# EasyEDA Pro project 面包板.eprj

# Schematic Schematic1
Create Date: 2023-08-23; Page Name: P1; Project Name: 面包板; Schematic Name: Schematic1; Update Date: 2023-08-23; Company: 嘉立创EDA; Page Size: A4; Version: V1.0
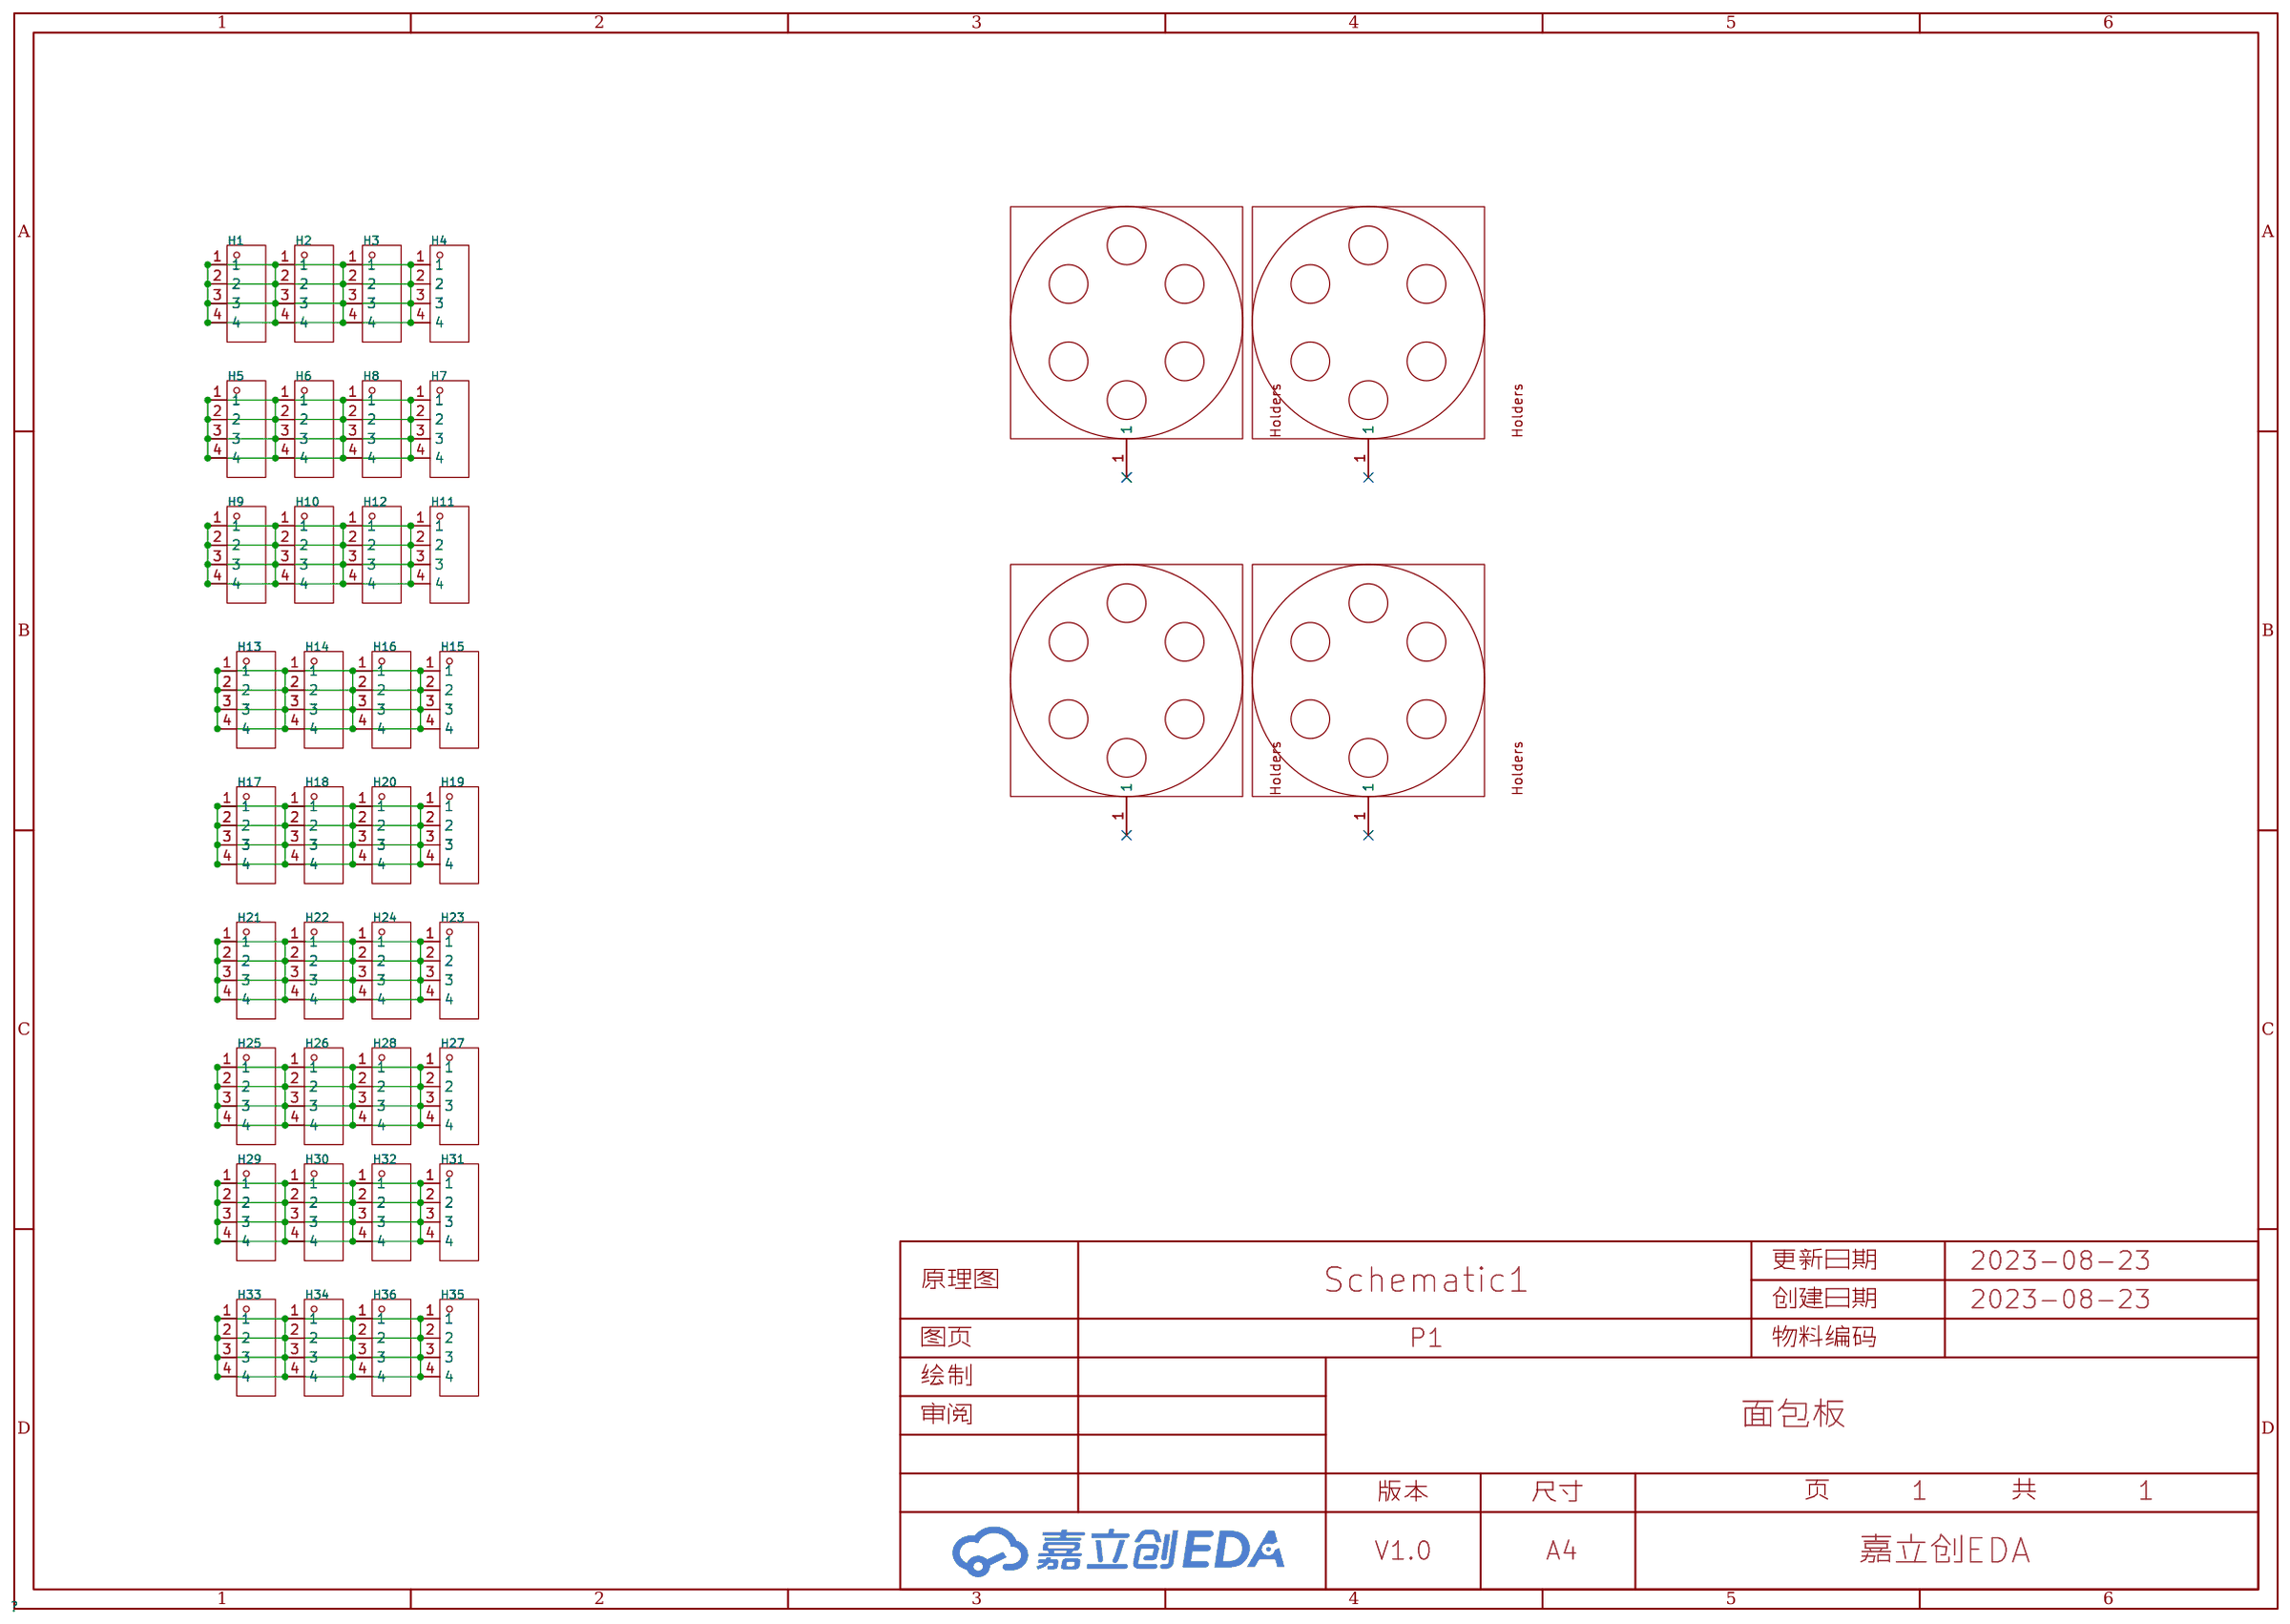
[diagram p0: schematic sheet]

## Parts
H1  PZ254V-11-04P  [HDR-TH_4P-P2.54-V-M]
H2  PZ254V-11-04P  [HDR-TH_4P-P2.54-V-M]
H3  PZ254V-11-04P  [HDR-TH_4P-P2.54-V-M]
H4  PZ254V-11-04P  [HDR-TH_4P-P2.54-V-M]
H5  PZ254V-11-04P  [HDR-TH_4P-P2.54-V-M]
H6  PZ254V-11-04P  [HDR-TH_4P-P2.54-V-M]
H7  PZ254V-11-04P  [HDR-TH_4P-P2.54-V-M]
H8  PZ254V-11-04P  [HDR-TH_4P-P2.54-V-M]
H9  PZ254V-11-04P  [HDR-TH_4P-P2.54-V-M]
H10  PZ254V-11-04P  [HDR-TH_4P-P2.54-V-M]
H11  PZ254V-11-04P  [HDR-TH_4P-P2.54-V-M]
H12  PZ254V-11-04P  [HDR-TH_4P-P2.54-V-M]
H13  PZ254V-11-04P  [HDR-TH_4P-P2.54-V-M]
H14  PZ254V-11-04P  [HDR-TH_4P-P2.54-V-M]
H15  PZ254V-11-04P  [HDR-TH_4P-P2.54-V-M]
H16  PZ254V-11-04P  [HDR-TH_4P-P2.54-V-M]
H17  PZ254V-11-04P  [HDR-TH_4P-P2.54-V-M]
H18  PZ254V-11-04P  [HDR-TH_4P-P2.54-V-M]
H19  PZ254V-11-04P  [HDR-TH_4P-P2.54-V-M]
H20  PZ254V-11-04P  [HDR-TH_4P-P2.54-V-M]
H21  PZ254V-11-04P  [HDR-TH_4P-P2.54-V-M]
H22  PZ254V-11-04P  [HDR-TH_4P-P2.54-V-M]
H23  PZ254V-11-04P  [HDR-TH_4P-P2.54-V-M]
H24  PZ254V-11-04P  [HDR-TH_4P-P2.54-V-M]
H25  PZ254V-11-04P  [HDR-TH_4P-P2.54-V-M]
H26  PZ254V-11-04P  [HDR-TH_4P-P2.54-V-M]
H27  PZ254V-11-04P  [HDR-TH_4P-P2.54-V-M]
H28  PZ254V-11-04P  [HDR-TH_4P-P2.54-V-M]
H29  PZ254V-11-04P  [HDR-TH_4P-P2.54-V-M]
H30  PZ254V-11-04P  [HDR-TH_4P-P2.54-V-M]
H31  PZ254V-11-04P  [HDR-TH_4P-P2.54-V-M]
H32  PZ254V-11-04P  [HDR-TH_4P-P2.54-V-M]
H33  PZ254V-11-04P  [HDR-TH_4P-P2.54-V-M]
H34  PZ254V-11-04P  [HDR-TH_4P-P2.54-V-M]
H35  PZ254V-11-04P  [HDR-TH_4P-P2.54-V-M]
H36  PZ254V-11-04P  [HDR-TH_4P-P2.54-V-M]
J1  -  [DEMO板安装孔]
J2  -  [DEMO板安装孔]
J3  -  [DEMO板安装孔]
J4  -  [DEMO板安装孔]

## Library data of the parts
H1-H36 = PZ254V-11-04P: 排数:单排;总PIN位数:4P;间距:2.54mm;插针结构:1x4P;行距:-;安装类型:直插;圆针/方针:方针;额定电流:3A;额定电压:250V;配合针长度:6mm;塑高:2.5mm;端接针长度:3mm;触头材质:-;工作温度范围:-40℃~+105℃;颜色:黑色;; LCSC Part Name: 2.54mm 1x4P 直插 方针; Supplier Part: C2691448; Manufacturer: XFCN(兴飞); Supplier Footprint: 插件,P=2.54mm; JLCPCB Part Class: Extended Part; Datasheet: https://atta.szlcsc.com/upload/public/pdf/source/20200309/C492403_F9F19131791D08044AD4F84F8E751A34.pdf; Supplier: LCSC; Number of Rows: 单排; Number of Pins: 4P; Pitch: 2.54mm; Pin Structure: 1x4P; Mounting Type: 直插; Circluar Pins/Square Pins: 方针; Current Rating (Max): 3A; Voltage Rating (Max): 250V; Length of Mating Pin: 6mm; Insulation Height: 2.5mm; Length of End Connection Pin: 3mm; Operating Temperature Range: -40℃~+105℃; Color: 黑色
J1-J4 = 螺孔_3.1X6MM

## Nets
$1N396: H1.1 H1.2 H1.3 H1.4 H2.1 H2.2 H2.3 H2.4 H3.1 H3.2 H3.3 H3.4 H4.1 H4.2 H4.3 H4.4
$1N597: H5.1 H5.2 H5.3 H5.4 H6.1 H6.2 H6.3 H6.4 H7.1 H7.2 H7.3 H7.4 H8.1 H8.2 H8.3 H8.4
$1N814: H9.1 H9.2 H9.3 H9.4 H10.1 H10.2 H10.3 H10.4 H11.1 H11.2 H11.3 H11.4 H12.1 H12.2 H12.3 H12.4
$1N1031: H13.1 H13.2 H13.3 H13.4 H14.1 H14.2 H14.3 H14.4 H15.1 H15.2 H15.3 H15.4 H16.1 H16.2 H16.3 H16.4
$1N1248: H17.1 H17.2 H17.3 H17.4 H18.1 H18.2 H18.3 H18.4 H19.1 H19.2 H19.3 H19.4 H20.1 H20.2 H20.3 H20.4
$1N1465: H21.1 H21.2 H21.3 H21.4 H22.1 H22.2 H22.3 H22.4 H23.1 H23.2 H23.3 H23.4 H24.1 H24.2 H24.3 H24.4
$1N1682: H25.1 H25.2 H25.3 H25.4 H26.1 H26.2 H26.3 H26.4 H27.1 H27.2 H27.3 H27.4 H28.1 H28.2 H28.3 H28.4
$1N1899: H29.1 H29.2 H29.3 H29.4 H30.1 H30.2 H30.3 H30.4 H31.1 H31.2 H31.3 H31.4 H32.1 H32.2 H32.3 H32.4
$1N2116: H33.1 H33.2 H33.3 H33.4 H34.1 H34.2 H34.3 H34.4 H35.1 H35.2 H35.3 H35.4 H36.1 H36.2 H36.3 H36.4

Not connected (* = marked no-connect by the designer): J1 1*; J2 1*; J3 1*; J4 1*

# Board PCB1
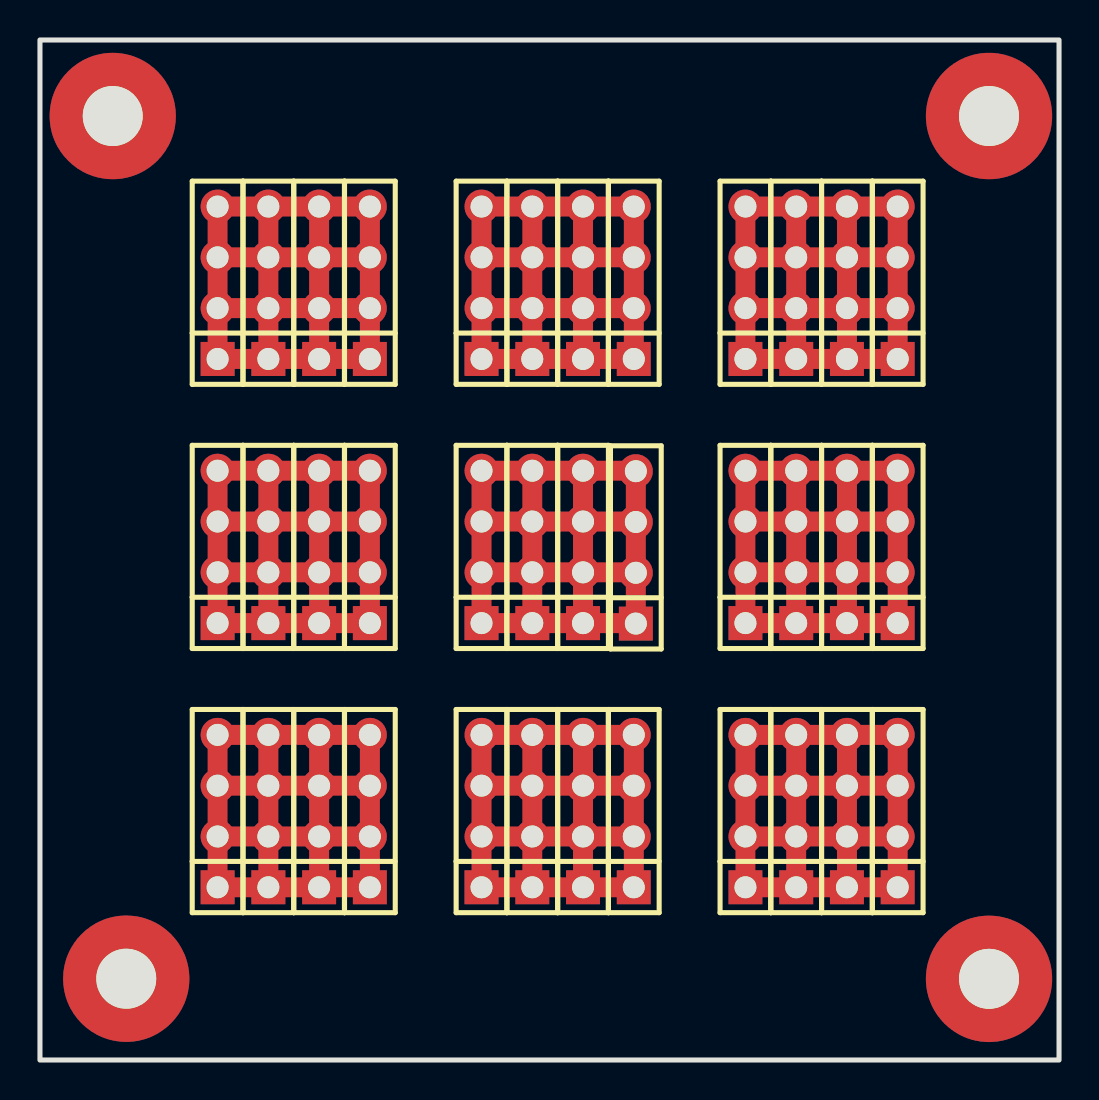
[diagram p1: board, top side]
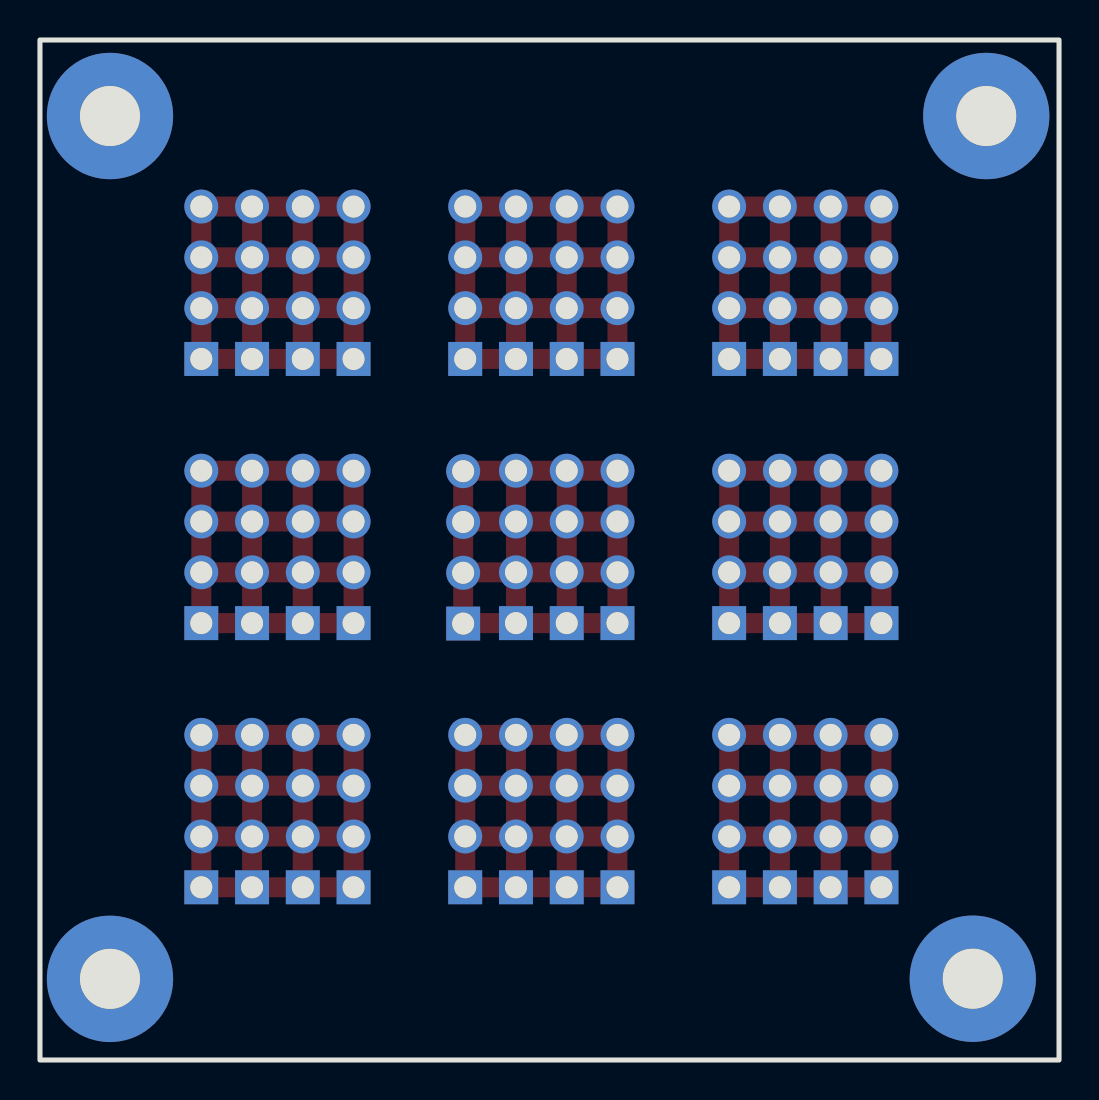
[diagram p2: board, bottom side, seen from below]

Outline 51 x 51 mm; copper layers: Top Layer, Bottom Layer. Coordinates in mm from the lower left corner of the outline.
Outline path: rectangle 0,51 51,0
Stack: Top Layer 0.035mm / Dielectric1 1.51mm FR4 er 4.5 / Bottom Layer 0.035mm

## Design rules (mm)
template: JLCPCB Capability(Two Layers Board)
spacing copperThickness1oz (default): track to track 0.102, other pairs 0.152 to 0.3
spacing copperThickness2oz: track to track 0.203, other pairs 0.152 to 0.3
track width copperThickness1oz (default): min 0.127, default 0.254, max 2.54
track width copperThickness2oz: min 0.203, default 0.254, max 2.54
differential pair differentialPair (default): width min 0.127, default 0.254, max 2.54; gap min 0.152, default 0.152
via viaSize (default): diameter min 0.5, default 0.61, max 10; hole min 0.3, default 0.305, max 6.3

## Placement (name value [footprint] x y rotation side)
H1  PZ254V-11-04P  [HDR-TH_4P-P2.54-V-M]  8.89 38.86 90 top
H2  PZ254V-11-04P  [HDR-TH_4P-P2.54-V-M]  11.43 38.86 90 top
H3  PZ254V-11-04P  [HDR-TH_4P-P2.54-V-M]  13.97 38.86 90 top
H4  PZ254V-11-04P  [HDR-TH_4P-P2.54-V-M]  16.51 38.86 90 top
H5  PZ254V-11-04P  [HDR-TH_4P-P2.54-V-M]  22.1 38.86 90 top
H6  PZ254V-11-04P  [HDR-TH_4P-P2.54-V-M]  24.64 38.86 90 top
H7  PZ254V-11-04P  [HDR-TH_4P-P2.54-V-M]  27.18 38.86 90 top
H8  PZ254V-11-04P  [HDR-TH_4P-P2.54-V-M]  29.72 38.86 90 top
H9  PZ254V-11-04P  [HDR-TH_4P-P2.54-V-M]  8.89 25.65 90 top
H10  PZ254V-11-04P  [HDR-TH_4P-P2.54-V-M]  11.43 25.65 90 top
H11  PZ254V-11-04P  [HDR-TH_4P-P2.54-V-M]  16.51 25.65 90 top
H12  PZ254V-11-04P  [HDR-TH_4P-P2.54-V-M]  13.97 25.65 90 top
H13  PZ254V-11-04P  [HDR-TH_4P-P2.54-V-M]  24.64 25.65 90 top
H14  PZ254V-11-04P  [HDR-TH_4P-P2.54-V-M]  22.1 25.65 90 top
H15  PZ254V-11-04P  [HDR-TH_4P-P2.54-V-M]  29.82 25.63 90 top
H16  PZ254V-11-04P  [HDR-TH_4P-P2.54-V-M]  27.18 25.65 90 top
H17  PZ254V-11-04P  [HDR-TH_4P-P2.54-V-M]  35.31 38.86 90 top
H18  PZ254V-11-04P  [HDR-TH_4P-P2.54-V-M]  37.85 38.86 90 top
H19  PZ254V-11-04P  [HDR-TH_4P-P2.54-V-M]  42.93 38.86 90 top
H20  PZ254V-11-04P  [HDR-TH_4P-P2.54-V-M]  40.39 38.86 90 top
H21  PZ254V-11-04P  [HDR-TH_4P-P2.54-V-M]  35.31 25.65 90 top
H22  PZ254V-11-04P  [HDR-TH_4P-P2.54-V-M]  37.85 25.65 90 top
H23  PZ254V-11-04P  [HDR-TH_4P-P2.54-V-M]  42.93 25.65 90 top
H24  PZ254V-11-04P  [HDR-TH_4P-P2.54-V-M]  40.39 25.65 90 top
H25  PZ254V-11-04P  [HDR-TH_4P-P2.54-V-M]  8.89 12.45 90 top
H26  PZ254V-11-04P  [HDR-TH_4P-P2.54-V-M]  11.43 12.45 90 top
H27  PZ254V-11-04P  [HDR-TH_4P-P2.54-V-M]  16.51 12.45 90 top
H28  PZ254V-11-04P  [HDR-TH_4P-P2.54-V-M]  13.97 12.45 90 top
H29  PZ254V-11-04P  [HDR-TH_4P-P2.54-V-M]  22.1 12.45 90 top
H30  PZ254V-11-04P  [HDR-TH_4P-P2.54-V-M]  24.64 12.45 90 top
H31  PZ254V-11-04P  [HDR-TH_4P-P2.54-V-M]  29.72 12.45 90 top
H32  PZ254V-11-04P  [HDR-TH_4P-P2.54-V-M]  27.18 12.45 90 top
H33  PZ254V-11-04P  [HDR-TH_4P-P2.54-V-M]  37.85 12.45 90 top
H34  PZ254V-11-04P  [HDR-TH_4P-P2.54-V-M]  35.31 12.45 90 top
H35  PZ254V-11-04P  [HDR-TH_4P-P2.54-V-M]  42.93 12.45 90 top
H36  PZ254V-11-04P  [HDR-TH_4P-P2.54-V-M]  40.39 12.45 90 top
J1  -  [demo板安装孔]  47.5 47.2 0 top
J2  -  [demo板安装孔]  3.64 47.2 0 top
J3  -  [demo板安装孔]  47.5 4.06 0 top
J4  -  [demo板安装孔]  4.32 4.06 0 top

## Footprints (pads in the part's own frame, mm; a bottom-side part is the same pattern mirrored in y, then rotated)
demo板安装孔
  round 6.32 hole 3: 1(0,0)
HDR-TH_4P-P2.54-V-M
  rect 1.7x1.7 hole 1.1: 1(-3.81,0)
  round 1.7 hole 1.1: 2(-1.27,0) 3(1.27,0) 4(3.81,0)

## Nets
As in the schematic.

Pads without a net: J1 1; J2 1; J3 1; J4 1

## Routing (per net, layer and track width the routed paths; a pad name or vN(x,y) marks a point on that pad's centre or on a via; arc(x,y) is an arc through that point)
$1N396: length 61
  Top Layer w1: H2.2 11.43,35.05 ; H2.2 H1.2 ; H2.2 H3.2 ; H2.2 11.43,40.13 ; 11.43,35.05 13.97,35.05 ; 11.43,35.05 8.89,35.05 H1.2 ; H1.2 8.89,40.13 ; 8.89,40.13 11.43,40.13 ; 8.89,40.13 H1.4 H2.4 ; 11.43,40.13 13.97,40.13 ; 11.43,40.13 H2.4 ; 13.97,40.13 H3.4 ; 13.97,40.13 16.51,40.13 ; 13.97,40.13 H3.2 ; H3.2 13.97,35.05 ; H3.2 H4.2 ; 13.97,35.05 16.51,35.05 H4.2 ; 16.51,40.13 H4.2 ; 16.51,40.13 H4.4 H3.4 ; H2.4 H3.4
$1N597: length 61
  Top Layer w1: 27.18,35.05 24.64,35.05 ; 27.18,35.05 29.72,35.05 H8.2 ; 27.18,35.05 H7.2 ; 24.64,35.05 22.1,35.05 H5.2 ; 24.64,35.05 H6.2 ; H7.2 H6.2 ; H7.2 H8.2 ; H7.2 27.18,40.13 ; H6.2 H5.2 ; H6.2 24.64,40.13 ; H5.2 22.1,40.13 ; H8.2 29.72,40.13 ; H7.4 H8.4 29.72,40.13 ; H7.4 H6.4 ; H7.4 27.18,40.13 ; H6.4 24.64,40.13 ; H6.4 H5.4 22.1,40.13 ; 24.64,40.13 27.18,40.13 ; 24.64,40.13 22.1,40.13 ; 27.18,40.13 29.72,40.13
$1N814: length 61
  Top Layer w1: 11.43,21.84 13.97,21.84 ; 11.43,21.84 8.89,21.84 H9.2 ; 11.43,21.84 H10.2 ; 13.97,21.84 16.51,21.84 H11.2 ; 13.97,21.84 H12.2 ; 13.97,26.92 16.51,26.92 ; 13.97,26.92 11.43,26.92 ; 13.97,26.92 H12.2 ; 13.97,26.92 H12.4 ; 16.51,26.92 H11.4 H12.4 ; 16.51,26.92 H11.2 ; H12.2 H10.2 ; H12.2 H11.2 ; H10.2 11.43,26.92 ; H10.2 H9.2 ; 11.43,26.92 8.89,26.92 ; 11.43,26.92 H10.4 ; 8.89,26.92 H9.2 ; 8.89,26.92 H9.4 H10.4 ; H12.4 H10.4
$1N1031: length 61.4
  Top Layer w1: 22.1,26.92 H14.2 ; 22.1,26.92 H14.4 H13.4 ; 22.1,26.92 24.64,26.92 ; H14.2 22.1,21.84 24.64,21.84 ; H14.2 H13.2 ; 24.64,26.92 H13.2 ; 24.64,26.92 H13.4 ; 24.64,26.92 27.18,26.92 ; H13.2 H16.2 ; H13.2 24.64,21.84 ; 24.64,21.84 27.18,21.84 ; 27.18,21.84 29.8,21.84 H15.1 H15.2 ; 27.18,21.84 H16.2 ; H15.3 H15.4 29.8,29.46 H16.4 ; H15.3 29.8,26.92 27.18,26.92 ; H15.3 H15.2 ; H16.2 29.8,24.38 H15.2 ; H16.2 27.18,26.92 ; 27.18,26.92 H16.4 ; H16.4 H13.4
$1N1248: length 61
  Top Layer w1: H20.2 40.39,35.05 ; H20.2 40.39,40.13 ; H20.2 H18.2 ; H20.2 H19.2 ; 40.39,35.05 37.85,35.05 ; 40.39,35.05 42.93,35.05 H19.2 ; H18.4 H17.4 35.31,40.13 ; H18.4 37.85,40.13 ; H18.4 H20.4 ; 42.93,40.13 H19.2 ; 42.93,40.13 40.39,40.13 ; 42.93,40.13 H19.4 H20.4 ; H20.4 40.39,40.13 ; 40.39,40.13 37.85,40.13 ; 37.85,40.13 H18.2 ; 37.85,40.13 35.31,40.13 ; H18.2 37.85,35.05 ; H18.2 H17.2 ; 37.85,35.05 35.31,35.05 H17.2 ; H17.2 35.31,40.13
$1N1465: length 61
  Top Layer w1: H21.2 H22.2 ; H21.2 35.31,26.92 ; H21.2 35.31,21.84 37.85,21.84 ; H22.2 37.85,26.92 ; H22.2 37.85,21.84 ; H22.2 H24.2 ; 35.31,26.92 37.85,26.92 ; 35.31,26.92 H21.4 H22.4 ; 37.85,26.92 40.39,26.92 ; 37.85,26.92 H22.4 ; 40.39,26.92 42.93,26.92 ; 40.39,26.92 H24.4 ; 40.39,26.92 H24.2 ; 40.39,21.84 37.85,21.84 ; 40.39,21.84 H24.2 ; 40.39,21.84 42.93,21.84 H23.2 ; 42.93,26.92 H23.2 ; 42.93,26.92 H23.4 H24.4 ; H24.2 H23.2 ; H24.4 H22.4
$1N1682: length 61
  Top Layer w1: 8.89,13.72 H25.4 H26.4 ; 8.89,13.72 H25.2 ; 8.89,13.72 11.43,13.72 ; 13.97,13.72 H28.2 ; 13.97,13.72 H28.4 ; 13.97,13.72 16.51,13.72 ; 13.97,13.72 11.43,13.72 ; H28.2 H26.2 ; H28.2 H28.1 ; H28.2 H27.2 ; H28.4 H26.4 ; H28.4 H27.4 16.51,13.72 ; 16.51,13.72 H27.2 ; H25.2 H26.2 ; H25.2 H25.1 H26.1 ; H26.2 H26.1 ; H26.2 11.43,13.72 ; H26.1 H28.1 ; H27.2 H27.1 H28.1 ; H26.4 11.43,13.72
$1N1899: length 61
  Top Layer w1: H29.2 22.1,13.72 ; H29.2 H30.2 ; H29.2 H29.1 H30.1 ; 22.1,13.72 24.64,13.72 ; 22.1,13.72 H29.4 H30.4 ; H30.2 H32.2 ; H30.2 H30.1 ; H30.2 24.64,13.72 ; H32.2 H32.1 ; H32.2 27.18,13.72 ; H32.2 H31.2 ; H32.4 H31.4 29.72,13.72 ; H32.4 H30.4 ; H32.4 27.18,13.72 ; H30.4 24.64,13.72 ; H30.1 H32.1 ; H31.2 H31.1 H32.1 ; H31.2 29.72,13.72 ; 29.72,13.72 27.18,13.72 ; 27.18,13.72 24.64,13.72
$1N2116: length 61
  Top Layer w1: H34.2 H34.1 H33.1 ; H34.2 H33.2 ; H34.2 35.31,13.72 ; 42.93,13.72 H35.2 ; 42.93,13.72 H35.4 H36.4 ; 42.93,13.72 40.39,13.72 ; H35.2 H35.1 H36.1 ; H35.2 H36.2 ; 37.85,13.72 H33.2 ; 37.85,13.72 40.39,13.72 ; 37.85,13.72 35.31,13.72 ; 37.85,13.72 H33.4 ; H33.2 H33.1 ; H33.2 H36.2 ; H33.4 H34.4 35.31,13.72 ; H33.4 H36.4 ; H36.4 40.39,13.72 ; 40.39,13.72 H36.2 ; H36.2 H36.1 ; H33.1 H36.1
